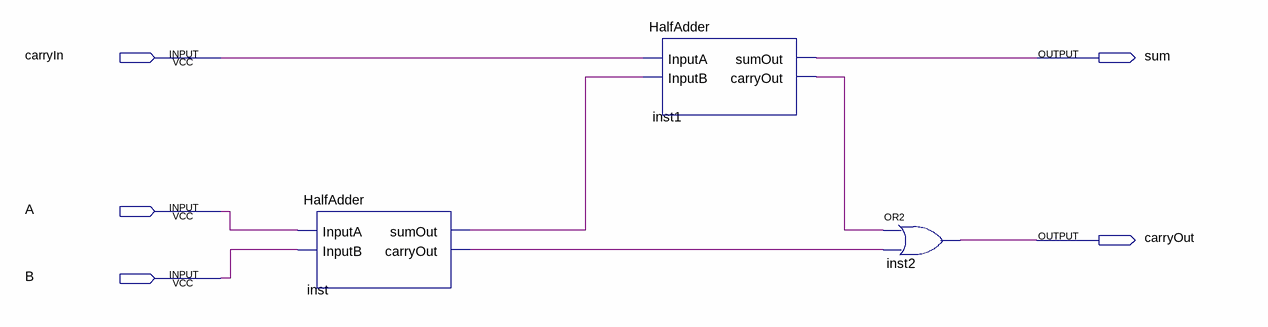
[diagram p0: schematic sheet]
// Quartus schematic FullAdder.bdf as structural Verilog: 3 symbols, 5 pins
module FullAdder (
  input  carryIn,
  input  A,
  input  B,
  output sum,
  output carryOut
);

  wire inst1_carryout, inst_carryout, inst_sumout;

  HalfAdder inst (.InputA(A), .InputB(B), .sumOut(inst_sumout), .carryOut(inst_carryout));
  HalfAdder inst1 (.InputA(carryIn), .InputB(inst_sumout), .sumOut(sum), .carryOut(inst1_carryout));
  or inst2 (carryOut, inst1_carryout, inst_carryout);
endmodule
